# EAGLE schematic pdb_v3 (EAGLE 9.4.2)
Robot power distribution board v2.0. Provides stable 5V and 3.3V rails, a direct power output, and I2C expansion.
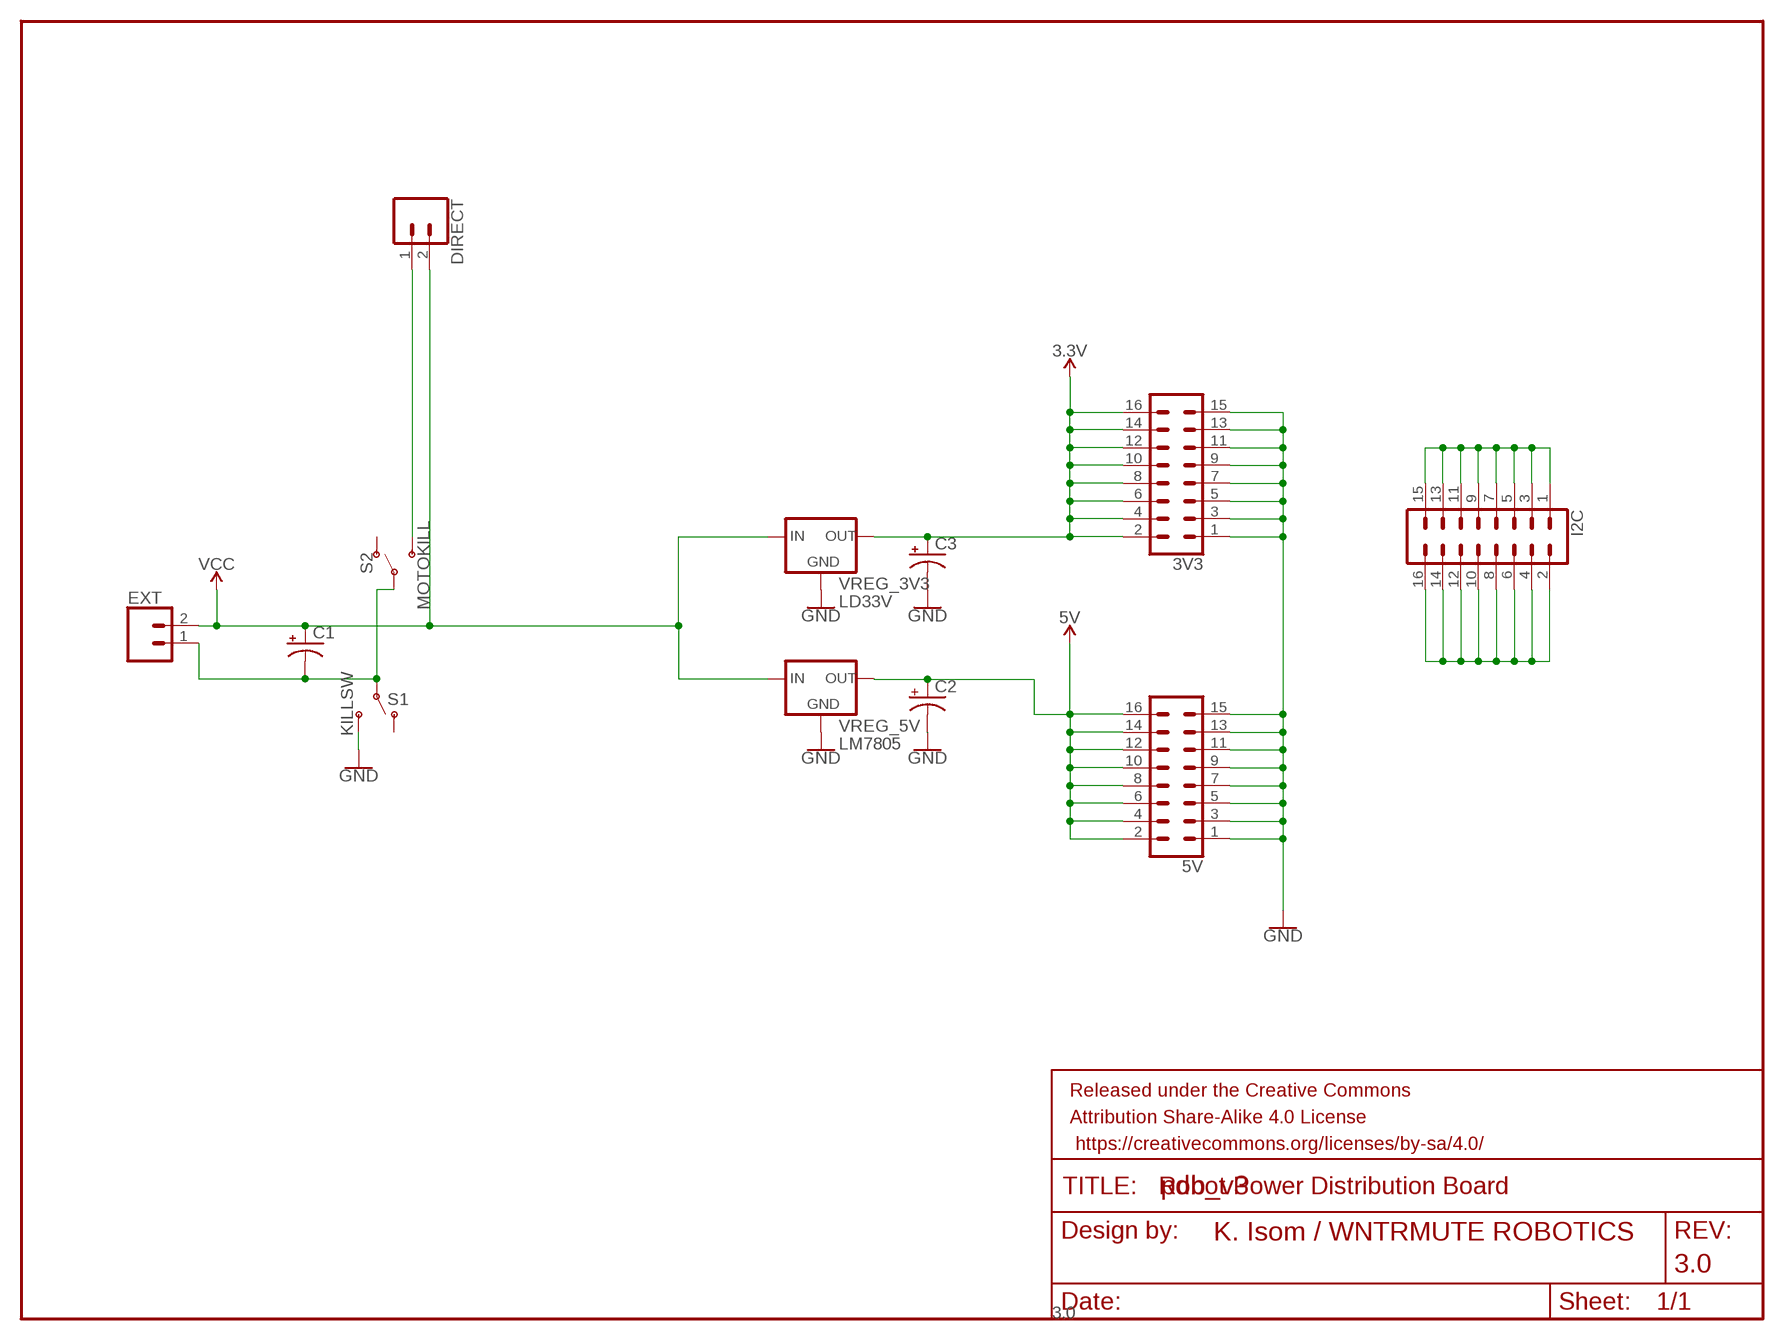
[diagram p0: schematic, sheet 1]

## Parts
3V3  CONN_08X2_HEADER  [2X8]
5V  CONN_08X2_HEADER  [2X8]
C1  1000uF  1000UF-RADIAL-5MM-25V-20%  [CPOL-RADIAL-5MM-10MM]
C2  100uF  CPOL-USE5-8.5  [E5-8,5]
C3  100uF  CPOL-USE5-8.5  [E5-8,5]
DIRECT  CONN_025MM  [SCREWTERMINAL-5MM-2]
EXT  CONN_025MM  [SCREWTERMINAL-5MM-2]
FRAME1  FRAME-LETTERNO_PACKAGE  [DUMMY]
I2C  CONN_08X2_HEADER  [2X8]
S1  KILLSW  SWITCH-SPDT-PTH-11.6X4.0MM-LOCK  [SWITCH_SPDT_PTH_11.6X4.0MM_LOCK]
S2  MOTOKILL  SWITCH-SPDT-PTH-11.6X4.0MM-LOCK  [SWITCH_SPDT_PTH_11.6X4.0MM_LOCK]
VREG_3V3  LD33V  V_REG_LD1117VXX  [78XXL]
VREG_5V  LM7805  V_REG_78XX-TO-220  [TO-220-ALT]

## Nets
3.3V: 3V3.2 3V3.4 3V3.6 3V3.8 3V3.10 3V3.12 3V3.14 3V3.16 C3.+ VREG_3V3.GND(OUT)
5V: 5V.2 5V.4 5V.6 5V.8 5V.10 5V.12 5V.14 5V.16 C2.+ VREG_5V.OUT
GND: 3V3.1 3V3.3 3V3.5 3V3.7 3V3.9 3V3.11 3V3.13 3V3.15 5V.1 5V.3 5V.5 5V.7 5V.9 5V.11 5V.13 5V.15 C2.- C3.- S1.3(S) VREG_3V3.IN(GND) VREG_5V.GND
N$1: C1.- EXT.1 S1.2(P) S2.2(P)
N$7: I2C.1 I2C.3 I2C.5 I2C.7 I2C.9 I2C.11 I2C.13 I2C.15
N$9: I2C.2 I2C.4 I2C.6 I2C.8 I2C.10 I2C.12 I2C.14 I2C.16
N$11: DIRECT.1 S2.3(S)
VCC: C1.+ DIRECT.2 EXT.2 VREG_3V3.OUT(IN) VREG_5V.IN
Unconnected: S1.1(O) S2.1(O)

## Notes on the sheet
- Robot Power Distribution Board

## Library data of the parts
3V3 5V I2C = SparkFun-Connectors:CONN_08X2: Multi connection point. Often used as Generic Header-pin footprint for 0.1 inch spaced/style header connections You can populate with any combo of single row headers, but if you'd like an exact match, check this: Header - 2x8 (Male, 0.1") <https://www.sparkfun.com/products/13156> (PRT-13156) On any of the 0.1 inch spaced packages, you can populate with these: Break Away Headers - Straight <https://www.sparkfun.com/products/116> (PRT-00116) Break Away Male Headers - Right Angle <https://www.sparkfun.com/products/553> (PRT-00553) Female Headers <https://www.sparkfun.com/products/115> (PRT-00115) Break Away Headers - Machine Pin <https://www.sparkfun.com/products/117> (PRT-00117) Break Away Female Headers - Swiss Machine Pin <https://www.sparkfun.com/products/743> (PRT-00743)
C1 = SparkFun-Capacitors:1000UF: 1,000µF/1mF ceramic capacitors A capacitor is a passive two-terminal electrical component used to store electrical energy temporarily in an electric field. CAP-08070; PROD_ID: CAP-09538; VALUE: 1mF
C2 C3 = rcl:CPOL-US: POLARIZED CAPACITOR, American symbol; SPICEPREFIX: C
DIRECT EXT = SparkFun-Connectors:CONN_02: Multi connection point. Often used as Generic Header-pin footprint for 0.1 inch spaced/style header connections On any of the 0.1 inch spaced packages, you can populate with these: Break Away Headers - Straight <https://www.sparkfun.com/products/116> (PRT-00116) Break Away Male Headers - Right Angle <https://www.sparkfun.com/products/553> (PRT-00553) Female Headers <https://www.sparkfun.com/products/115> (PRT-00115) Break Away Headers - Machine Pin <https://www.sparkfun.com/products/117> (PRT-00117) Break Away Female Headers - Swiss Machine Pin <https://www.sparkfun.com/products/743> (PRT-00743) For SCREWTERMINALS and SPRING TERMINALS visit here: Screw Terimnals on SparkFun.com <https://www.sparkfun.com/search/results?term=Screw+Terminals> (5mm/3.5mm/2.54mm spacing) This device is also useful as a general connection point to wire up your design to another part of your project. Our various solder wires solder well into these plated through hole pads. Hook-Up Wire - Assortment (Stranded, 22 AWG) <https://www.sparkfun.com/products/11375> (PRT-11375) Hook-Up Wire - Assortment (Solid Core, 22 AWG) <https://www.sparkfun.com/products/11367> (PRT-11367) View the entire wire category on our website here <https://www.sparkfun.com/categories/141> Special notes: Molex polarized connector foot print use with: PRT-08233 with associated crimp pins and housings. 2.54_SCREWTERM for use with PRT-10571. 3.5mm Screw Terminal footprints for PRT-08084 5mm Screw Terminal footprints for use with PRT-08432; SF_SKU: PRT-08432
FRAME1 = SparkFun-Aesthetics:FRAME-LETTER: Schematic Frame - Letter Standard 8.5x11 US Letter frame; DESIGNER: K. Isom / WNTRMUTE ROBOTICS; REV: 3.0; VERSION: 3.0
S1 S2 = SparkFun-Switches:SWITCH-SPDT: Single Pole, Double Throw (SPDT) Switch Single-pole, double-throw (SPDT) switch. Variant Overview SMD-AYZ0202 Surface Mount DPDT Switch <https://www.sparkfun.com/products/597> (COM-00597) Used on e.g. LilyPad Arduino USB - ATmega32U4 Board <https://www.sparkfun.com/products/12049> PTH-11.6X4.0MM SPDT Mini Power Switch <https://www.sparkfun.com/products/102> (COM-00102) Used on e.g. SparkFun Simon Says - Through-Hole Soldering Kit <https://www.sparkfun.com/products/10547> (KIT-10547) PTH-11.6X4.0MM-KIT KIT version of SPDT Mini Power Switch - Simplifies soldering by removing tStop of switch pins - only one side can be soldered. PTH-11.6X4.0MM-LOCK LOCK version of SPDT Mini Power Switch - Offset pins hold switch in place for easier soldering. SMD-RIGHT-ANGLE Surface Mount Right Angle Switch <https://www.sparkfun.com/products/10860> (COM-10860) Used on e.g. SparkFun ESP8266 Thing <https://www.sparkfun.com/products/13231>; PROD_ID: SWCH-08261; SF_SKU: COM-00102
VREG_3V3 = SparkFun-IC-Power:V_REG_LD1117VXX: LD1117VXX voltage regulator. We carry the 3.3V version (COM-00526) in TO-220 package.
VREG_5V = SparkFun-IC-Power:V_REG_78XX: Voltage Regulator Standard 78xx regulator. IGO (Input Ground Output). Spark Fun Electronics SKU : COM-00107; PROD_ID: VREG-08450; SF_ID: COM-00107